# Altium schematic sheet OpAmpSCH.SchDoc: SCH_Template
size B; Engineer: Benjamin Beaudoin; Revision: vX.X
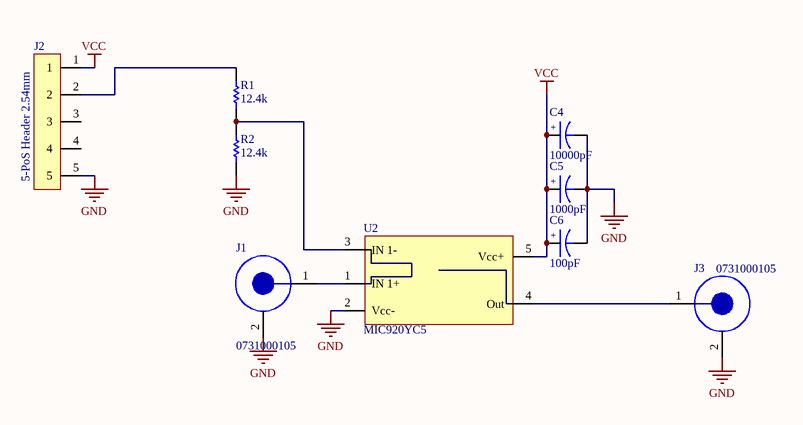
[diagram p0: OpAmpSCH.SchDoc]

## Parts
C4  10000pF  [0603C]
C5  1000pF  [0603C]
C6  100pF  [0603C]
J1  0731000105  [0731000105]
J2  5-PoS Header 2.54mm  [2.54mm Pitch Header]
J3  0731000105  [0731000105]
R1  12.4k  [0603C]
R2  12.4k  [0603C]
U2  MIC920YC5  [MIC920]

## Nets
GND: C4.2 C5.2 C6.2 J1.2 J2.5 J3.2 R2.1 U2.2(Vcc-)
VCC: C4.1 C5.1 C6.1 J2.1 U2.5(Vcc+)
NetJ1_1: J1.1 U2.1(IN_1+)
NetJ2_2: J2.2 R1.2
NetJ3_1: J3.1 U2.4(Out)
NetR1_1: R1.1 R2.2 U2.3(IN_1-)

Not connected (* = marked no-connect by the designer): J2 3 4

## Notes on the sheet
- (in symbol CPoly) +

## Library data of the parts
C4-C6 = CPoly: Cap Poly; Power_WV_SRF: 35V; MFG: *; MFGPN: *; Tolerance: *; Temp Coef: *; Distributor Reg Num: *; Distributor: *; CMPN: *
  C4: Value: 10000pF
  C5: Value: 1000pF
  C6: Value: 100pF
J1 J3 = 0731000105: BNC Connector Jack, Female Socket 50Ohm Through Hole, Right Angle Solder
R1 R2 = R: Resistor; Tolerance: 5%; Value: 12.4k; Power_WV_SRF: *; MFG: *; MFGPN: *; Distributor: *; CMPN: *
U2 = MIC920YC5-TR: General Purpose Amplifier 1 Circuit SC-70-5